# Altium schematic sheet 5V_LDO.SchDoc: 5V_LDO.SchDoc
size 558 x 431 mm; Date: 2/16/2022; Author: Xitong Zheng, Hongliang Chen; SheetNumber: 5; SheetTotal: 11
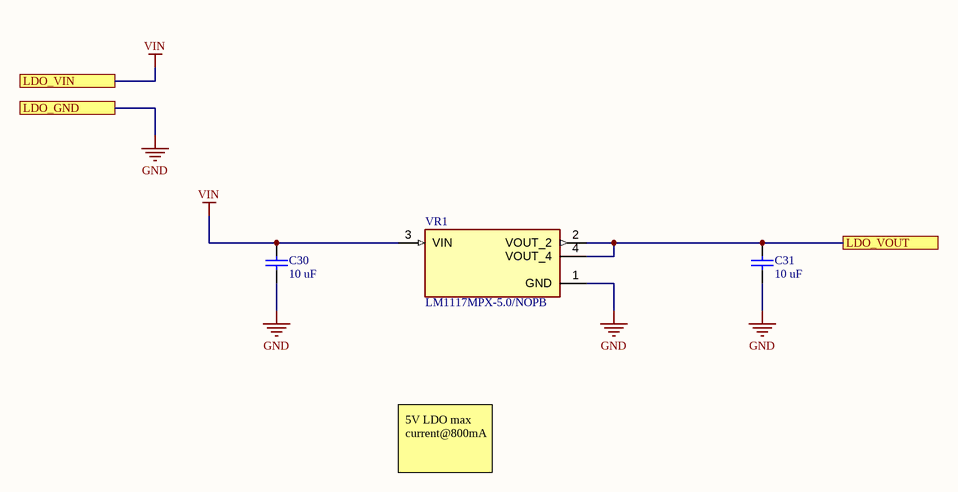
[diagram p0: 5V_LDO.SchDoc]

## Parts
C30  10 uF  [CAPC2013X95X50LL10T25]
C31  10 uF  [CAPC2013X95X50LL10T25]
VR1  LM1117MPX-5.0/NOPB  [VREG_LM1117MPX-5.0/NOPB]

## Ports
LDO_GND, LDO_VIN, LDO_VOUT

## Nets
GND: C30.1 C31.1 VR1.1(GND) ; port LDO_GND
VIN: C30.2 VR1.3(VIN) ; port LDO_VIN
LDO_VOUT: C31.2 VR1.2(VOUT_2) VR1.4(VOUT_4) ; port LDO_VOUT

## Notes on the sheet
- 5V LDO max current@800mA
- DWG. NO.
- REV.
- SHT.
- REVISION
- DESCRIPTION
- DATE
- APPROVED
- THIS DOCUMENT AND THE DATA DISCLOSED HEREIN OR HEREWITH IS THE PROPERTY OF ALTIUM LIMITED AND MAY BE FREELY DISTRIBUTED IN WHOLE. NO RIGHTS ARE RESERVED OR EXPRESS OR IMPLIED WARANTEE GIVEN.
- ENG:
- DSN:
- APPROVALS
- PROJECT
- DOCUMENT REVISION:
- DESIGN ITEM:
- CHK:
- BOM:
- REFERENCE DOCUMENTS
- PROJECT REVISION:
- TITLE
- FAB DWG:
- PCB DWG:
- ASSY DWG:
- SCALE:
- SIZE
- C
- CAGE CODE
- FILE NAME
- DWG NO.
- SHEET
- OF
- REV

## Library data of the parts
C30 C31 = CMP-2000-06497-1: Chip Capacitor, 10 uF, +/- 10%, 6.3 V, -55 to 85 degC, 0805 (2012 Metric), RoHS, Tape and Reel; Manufacturer: Taiyo Yuden; PCN Part Number: X5R,X7RDielectrics23/Jan/2008; Other Names: 587-1304-6; Capacitance: 10µF; Temperature Coefficient: X5R; Catalog Drawings: xMKSeries_0805_0.85; Voltage - Rated: 6.3V; Online Catalog: MSeries; Package Reference: 0805; Family: CeramicCapacitors; Packaging: Digi-Reel®; Thickness (Max): 0.037"(0.95mm); Ratings: -; Package / Case: 0805(2012Metric); Datasheet URL: http://www.yuden.co.jp/productdata/catalog/en/mlcc_all_e.pdf; Mounting Type: SurfaceMount,MLCC; Manufacturer URL: http://www.t-yuden.com/; Category: Capacitors; Applications: GeneralPurpose; Size / Dimension: 0.079"Lx0.049"W(2.00mmx1.25mm); Height - Seated (Max): -; Features: -; Lead Style: -; Lead Spacing: -; Standard Package: 1; Mounting Technology: SurfaceMount; Series: M; Operating Temperature: -55°C~85°C; Tolerance: ±10%; Datasheet Version: 09/2015; Package Description: 2-Pin Surface Mount Device, Body 2 x 1.25 mm
VR1 = LM1117MPX-5.0/NOPB: 800-mA 15-V linear voltage regulator 4-SOT-223 0 to 125; MF: {'manufacturer': u'ON Semiconductor'}; Value: *; MP: LM1117MPX-5.0/NOPB; Package: None; Price: None; Availability: Unavailable